# EAGLE design schema1 (EAGLE 6.5.0)
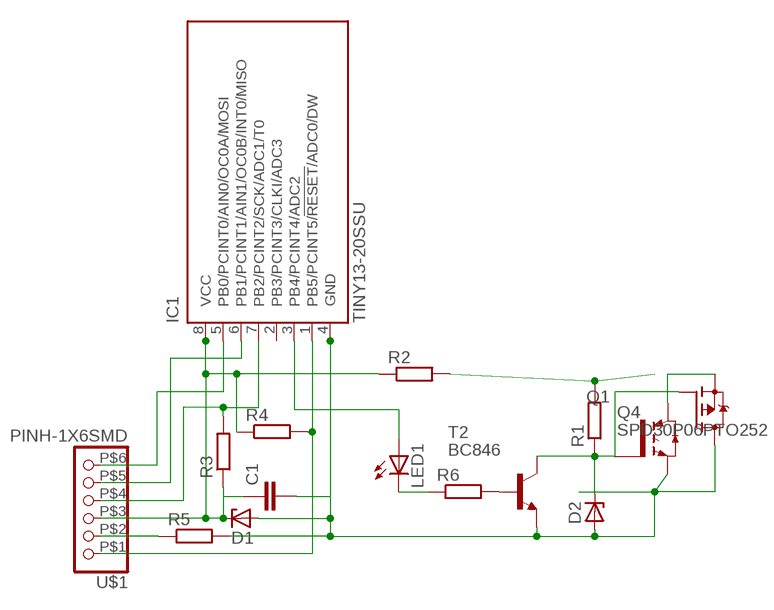
[diagram p0: schematic, sheet 1]

## Parts
C1  C-EUC0603  [C0603]
D1  ZENER-DIODESOD80C  [SOD80C]
D2  ZENER-DIODESOD80C  [SOD80C]
IC1  TINY13-20SSU  [8S1]
LED1  LEDSML1206  [SML1206]
Q1  IRG4BC15UD-S  [D2PACK]
Q4  SPD30P06PTO252  [TO252]
R1  R-EU_R1206  [R1206]
R2  R-EU_R1206  [R1206]
R3  R-EU_R1206  [R1206]
R4  R-EU_R1206  [R1206]
R5  R-EU_R1206  [R1206]
R6  R-EU_R1206  [R1206]
T2  BC846  [SOT23]
U$1  PINH-1X6SMD  [1X06/90SMD]

## Nets
N$1: D2.C Q1.1(G) Q4.1(G) R1.1 T2.3(C)
N$2: R6.2 T2.1(B)
N$3: IC1.3(PB4/PCINT4/ADC2) LED1.A
N$5: C1.2 D1.A D2.A IC1.4(GND) Q1.3(E) Q4.3(D) R5.2 T2.2(E)
N$6: C1.1 D1.C IC1.8(VCC) R2.1 R3.1 R4.1 U$1.P$3
N$7: IC1.7(PB2/PCINT2/SCK/ADC1/T0) R3.2 U$1.P$4
N$8: IC1.1(PB5/PCINT5/!RESET!/ADC0/DW) R4.2 U$1.P$1
N$9: R1.2 R2.2
N$11: LED1.C R6.1
N$12: R5.1 U$1.P$2
N$13: IC1.6(PB1/PCINT1/AIN1/OC0B/INT0/MISO) U$1.P$5
N$14: IC1.5(PB0/PCINT0/AIN0/OC0A/MOSI) U$1.P$6
N$15: Q1.2(C) Q4.2(S)
Unconnected: IC1.2(PB3/PCINT3/CLKI/ADC3)

## Library data of the parts
C1 = rcl:C-EU: CAPACITOR, European symbol
D1 D2 = diode:ZENER-DIODE: Z-Diode
IC1 = atmel:TINY13: 8-bit AVR Microcontroller with 1K Bytes In-System Programmable Flash Source: http://www.atmel.com/dyn/resources/prod_documents/2535S.pdf; MPN: ATTINY13-20SSU; OC_FARNELL: 1455133; OC_NEWARK: 58M3771
LED1 = led:LED: LED OSRAM: - CHIPLED LG R971, LG N971, LY N971, LG Q971, LY Q971, LO R971, LY R971 LH N974, LH R974 LS Q976, LO Q976, LY Q976 LO Q996 - Hyper CHIPLED LW Q18S LB Q993, LB Q99A, LB R99A - SideLED LS A670, LO A670, LY A670, LG A670, LP A670 LB A673, LV A673, LT A673, LW A673 LH A674 LY A675 LS A676, LA A676, LO A676, LY A676, LW A676 LS A679, LY A679, LG A679 - Hyper Micro SIDELED® LS Y876, LA Y876, LO Y876, LY Y876 LT Y87S - SmartLED LW L88C, LW L88S LB L89C, LB L89S, LG L890 LS L89K, LO L89K, LY L89K LS L896, LA L896, LO L896, LY L896 - TOPLED LS T670, LO T670, LY T670, LG T670, LP T670 LSG T670, LSP T670, LSY T670, LOP T670, LYG T670 LG T671, LOG T671, LSG T671 LB T673, LV T673, LT T673, LW T673 LH T674 LS T676, LA T676, LO T676, LY T676, LB T676, LH T676, LSB T676, LW T676 LB T67C, LV T67C, LT T67C, LS T67K, LO T67K, LY T67K, LW E67C LS E67B, LA E67B, LO E67B, LY E67B, LB E67C, LV E67C, LT E67C LW T67C LS T679, LY T679, LG T679 LS T770, LO T770, LY T770, LG T770, LP T770 LB T773, LV T773, LT T773, LW T773 LH T774 LS E675, LA E675, LY E675, LS T675 LS T776, LA T776, LO T776, LY T776, LB T776 LHGB T686 LT T68C, LB T68C - Hyper Mini TOPLED® LB M676 - Mini TOPLED Santana® LG M470 LS M47K, LO M47K, LY M47K Source: http://www.osram.convergy.de LUXEON: - LUMILED® LXK2-PW12-R00, LXK2-PW12-S00, LXK2-PW14-U00, LXK2-PW14-V00 LXK2-PM12-R00, LXK2-PM12-S00, LXK2-PM14-U00 LXK2-PE12-Q00, LXK2-PE12-R00, LXK2-PE12-S00, LXK2-PE14-T00, LXK2-PE14-U00 LXK2-PB12-K00, LXK2-PB12-L00, LXK2-PB12-M00, LXK2-PB14-N00, LXK2-PB14-P00, LXK2-PB14-Q00 LXK2-PR12-L00, LXK2-PR12-M00, LXK2-PR14-Q00, LXK2-PR14-R00 LXK2-PD12-Q00, LXK2-PD12-R00, LXK2-PD12-S00 LXK2-PH12-R00, LXK2-PH12-S00 LXK2-PL12-P00, LXK2-PL12-Q00, LXK2-PL12-R00 Source: www.luxeon.com KINGBRIGHT: KA-3528ASYC Source: www.kingbright.com
Q1 = transistor-power:IRG4BC15UD-: INSULATED GATE BIPOLAR TRANSISTOR WITH ULTRAFAST SOFT RECOVERY DIODE
Q4 = transistor-fet:SPD30P06P: SIPMOS(R) Power-Transistor P-Channel, Enhancement mode Source: http://www.infineon.com/upload/Document/cmc_upload/documents/012/3615/SPD_U30P06P.pdf
R1-R6 = rcl:R-EU_: RESISTOR, European symbol
T2 = transistor:BC846: NPN TRANSISTOR
U$1 = pinhead:PINH-1X6SMD

## Board
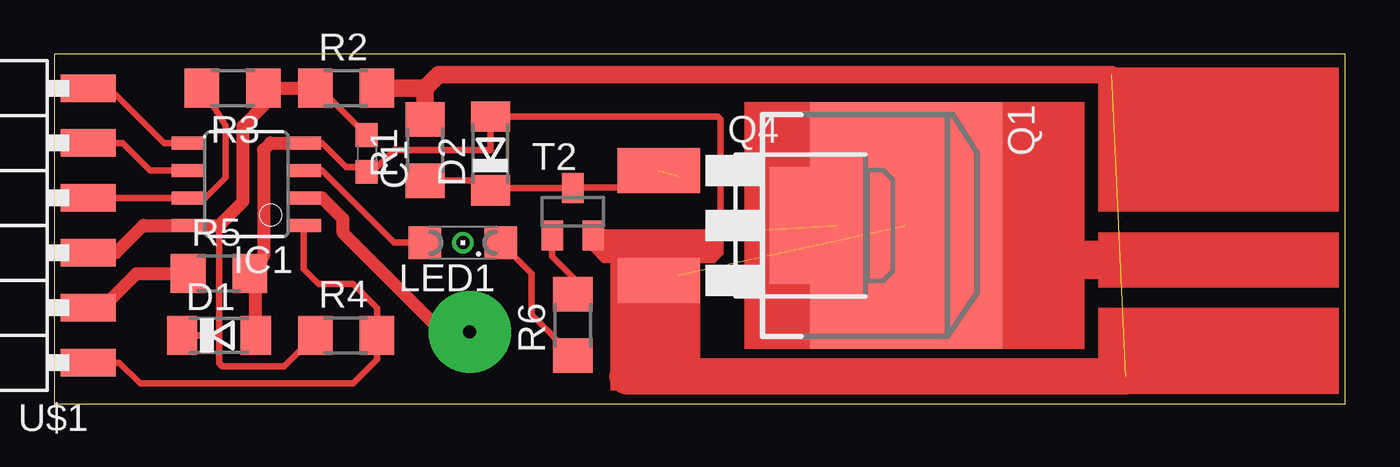
[diagram p1: board, top side]

Size 59.68 x 16.18 mm. Coordinates in mm from the lower left corner, seen from the top.
Outline: 0,0 59.68,0 59.68,16.18 0,16.18 0,0
Copper layers (1*16): Top 0.035mm / dielectric 1.5mm / Bottom 0.035mm
Design rules "default": minimum track width 10mil, minimum drill 24mil, track to track 8mil, track to pad 8mil, pad to pad 8mil, via to via 8mil, smd to smd 8mil, copper to edge 40mil, drill to drill 8mil, minimum pad ring 10mil, minimum via ring 8mil, stop-mask expansion 4mil, vias tented up to drill 0mil, thermal gap 10mil

### Footprints (pad centres in the part's own frame; a part is rotated, then mirrored left to right if it is on the bottom)
C0603 = smd 1.1 x 1: 1 -0.85,0; 2 0.85,0
SOD80C = smd 1.4 x 1.8: A 1.7,0; C -1.7,0
8S1 = smd 0.6 x 1.6: 1 -1.905,-2.654; 2 -0.645,-2.654; 3 0.625,-2.654; 4 1.895,-2.654; 5 1.905,2.654; 6 0.635,2.654; 7 -0.635,2.654; 8 -1.905,2.654
SML1206 = smd 1.5 x 1.5: A 1.75,0; C -1.75,0
D2PACK = smd 2.083 x 3.81: 1 -2.54,-8.89; 3 2.54,-8.89 | smd 11.43 x 8.89: 2 0,2.54
TO252 = smd 1 x 1.6: 1 -2.28,-4.8; 2 2.28,-4.8 | smd 5.4 x 6.2: 3 0,2.5
R1206 = smd 1.6 x 1.803: 1 -1.422,0; 2 1.422,0
SOT23 = smd 1 x 1.4: 1 -0.95,-1.1; 2 0.95,-1.1; 3 0,1.1
1X06/90SMD = smd 1.27 x 2.54: P$1 -6.35,-3.81; P$2 -3.81,-3.81; P$3 -1.27,-3.81; P$4 1.27,-3.81; P$5 3.81,-3.81; P$6 6.35,-3.81

### Placement (x,y rotation side)
C1  14.45,11.59 270 top
D1  7.62,3.17 0 top
D2  20.16,11.59 90 top
IC1  8.89,10.16 90 top
LED1  18.89,7.46 180 top
Q1  36.83,8.25 270 top
Q4  33.66,8.25 270 top
R1  17.14,11.75 90 top
R2  13.49,14.61 0 top
R3  8.26,14.61 180 top
R4  13.49,3.17 0 top
R5  7.62,6.03 0 top
R6  23.97,3.65 90 top
T2  23.97,8.89 0 top
U$1  -2.22,8.25 90 top

### Tracks (layer width: path | path; a pad name or v marks a point on that pad's centre or on a via)
N$1  (1 unrouted)
  Top 0.305: R1.1 19.72,10.32 D2.C 20.26,9.99 T2.3 23.98,10 26.67,10 27.46,10.79 Q1.1
N$2
  Top 0.305: T2.1 23.02,6.82 23.97,5.87 R6.2
N$3
  Top 0.305: IC1.3 12.39,10.79 15.72,7.46 LED1.A
N$5  (1 unrouted)
  Top 0.305: IC1.4 12.39,12.05 13.49,10.95 14.07,10.95 C1.2 14.87,10.9 15.72,11.75 20.16,11.75 D2.A 30.69,13.29 30.8,13.18 30.8,7.94 | R5.2 9.04,6.5 9.21,6.67 | 30.8,7.94 27.94,7.94 | 27.94,7.94 25.07,7.94 T2.2 27.79,7.79 27.94,7.94 | 27.94,7.94 Q1.3 | 30.8,7.94 30.8,6.98 30.48,6.67 25.4,6.67 24.92,7.14
  Top 0.406: 9.04,3.45 D1.A
  Top 0.61: D1.A 9.32,5.75 R5.2 9.68,6.83 9.68,11.75 10,12.06 11.53,12.06 IC1.4
N$6
  Top 0.305: D1.C 7.62,3.17 | 7.62,3.17 7.62,8.25 | 7.62,3.17 7.62,1.9 7.78,1.75 10.64,1.75 R4.1 | R3.1 9.04,14.12 | R2.1 12.28,14.61 C1.1
  Top 0.61: U$1.P$3 2.86,6.98 4.13,8.25 IC1.8 7.62,8.25 8.73,9.37 8.73,12.86 9.68,13.81 9.68,14.6 R3.1 R2.1
N$7
  Top 0.305: U$1.P$4 IC1.7 6.98,9.52 7.94,10.48 7.94,12.87 R3.2
N$8
  Top 0.305: U$1.P$1 3.02,1.9 3.97,0.95 13.81,0.95 14.92,2.06 R4.2 14.92,3.18 14.92,4.45 13.81,5.56 12.22,5.56 11.54,6.24 IC1.1
N$9  (1 unrouted)
  Top 0.813: 48.9,15.24 17.78,15.24 17.14,14.61 | R2.2 17.14,14.61 | 17.14,14.61 R1.2
  Top 1.676: 26.51,1.27 49.53,1.27
N$10
  Top 1.778: 49.21,6.67 42.86,6.67
N$11
  Top 0.305: 20.32,7.3 LED1.C 22.07,6.04 22.07,4.13 R6.1
N$12
  Top 0.406: U$1.P$2 2.22,4.45
  Top 0.61: 2.22,4.45 3.81,6.03 R5.1
N$13
  Top 0.305: U$1.P$5 3.18,12.06 4.45,10.79 IC1.6
N$14
  Top 0.305: 2.54,14.61 5.08,12.06 IC1.5
  Top 0.406: U$1.P$6 2.54,14.61
N$15  (1 unrouted)
N$16  (via drill 0.6 pad 3.81)
  Top 0.61: 11.43,9.52 12.38,9.52 13.34,8.57 13.34,7.94 17.94,3.33 v19.21,3.33
N$17
  Top 1.422: 30.16,7.3 25.72,7.3
N$18  (via drill 0.6 pad 0.81)
  other vias: 18.89,7.46
(copper drawn outside any net)
  shapes: Top area x10